# EasyEDA Pro project V4-POJ-STM32F103C8T6最小系统.epro

# Schematic Schematic1
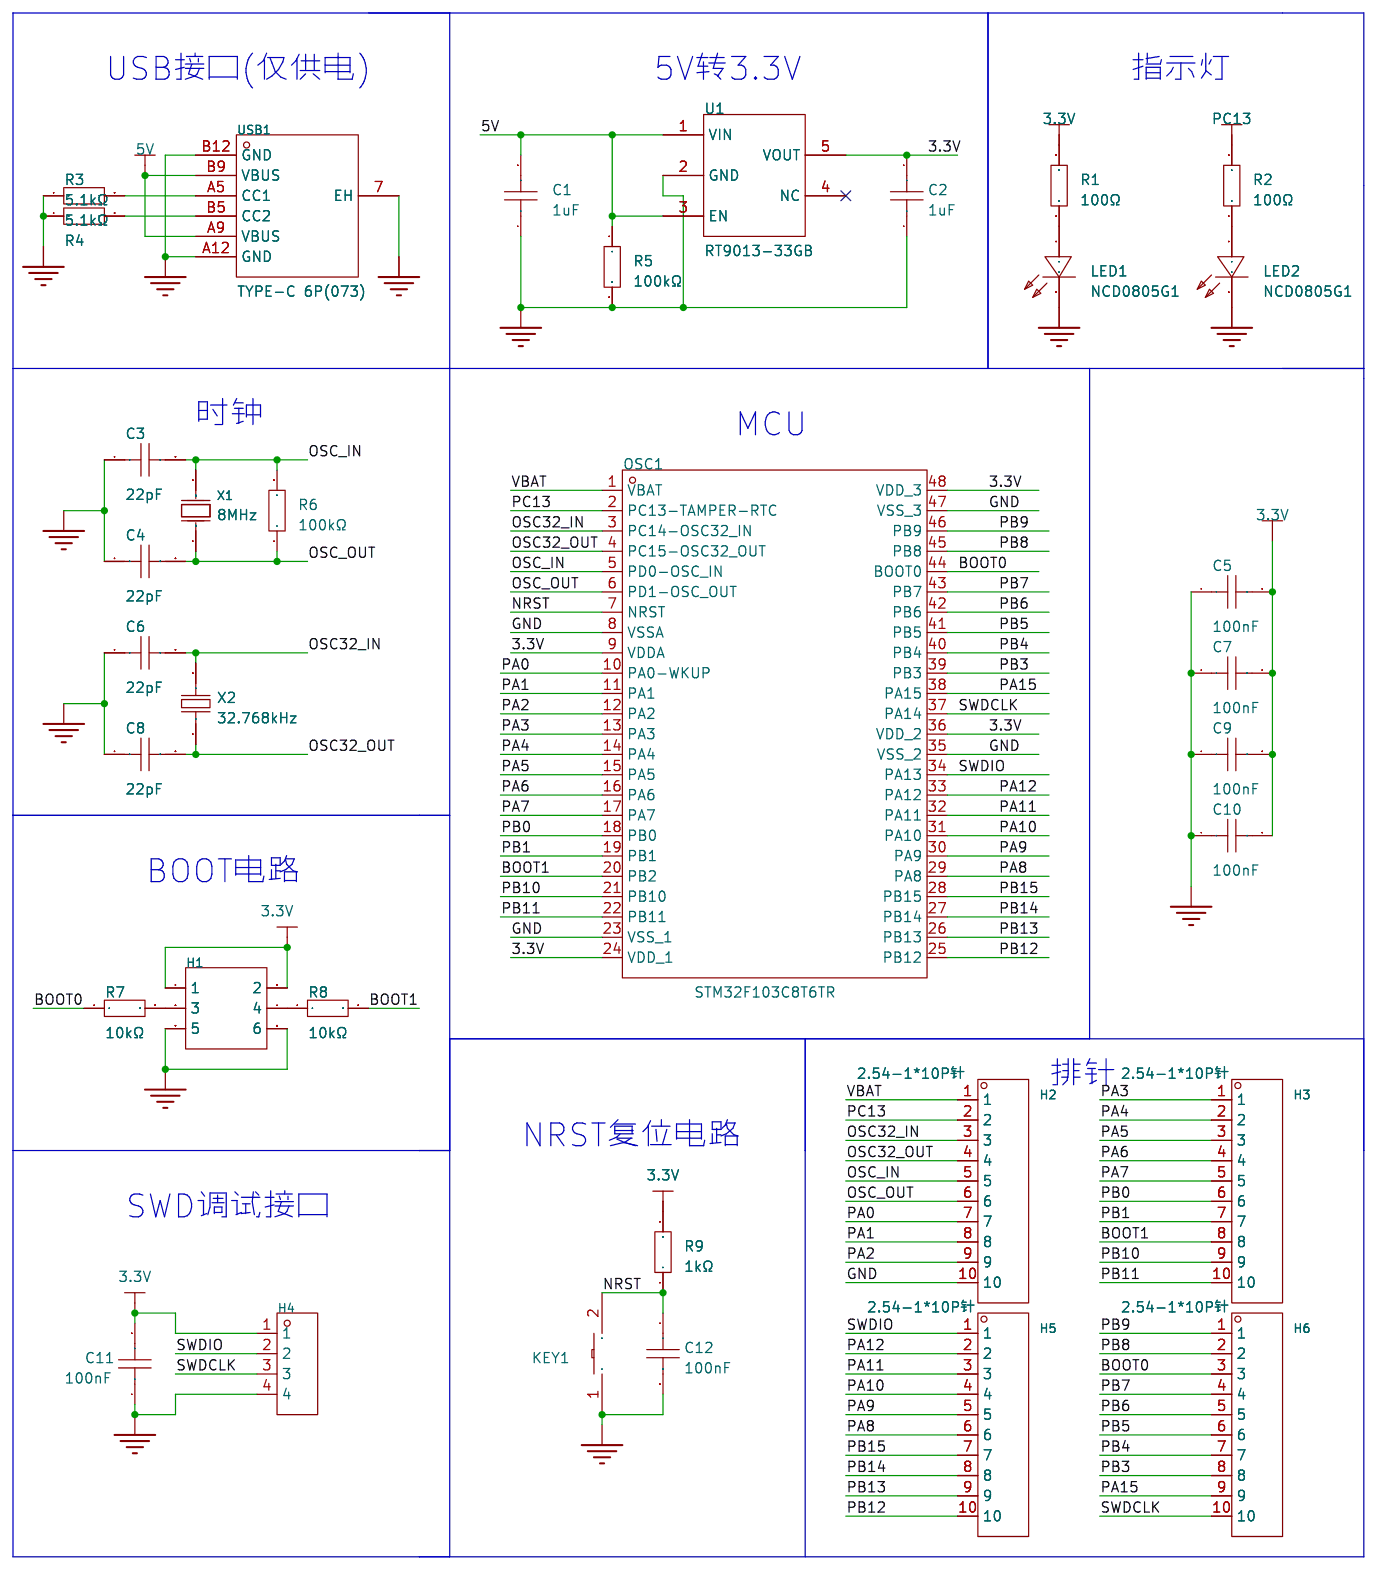
[diagram p0: schematic sheet]

## Parts
C1  1uF  [C0805]
C2  1uF  [C0805]
C3  22pF  [C0805]
C4  22pF  [C0805]
C5  100nF  [C0805]
C6  22pF  [C0805]
C7  100nF  [C0805]
C8  22pF  [C0805]
C9  100nF  [C0805]
C10  100nF  [C0805]
C11  100nF  [C0805]
C12  100nF  [C0805]
H1  2.54-2*3P针  [HDR-TH_6P-P2.54-V-M-R2-C3-S2.54-1]
H2  2.54-1*10P针  [HDR-TH_10P-P2.54-V-M-1]
H3  2.54-1*10P针  [HDR-TH_10P-P2.54-V-M-1]
H4  PZ254R-11-04P  [HDR-TH_4P-P2.54-H-M-W10.4]
H5  2.54-1*10P针  [HDR-TH_10P-P2.54-V-M-1]
H6  2.54-1*10P针  [HDR-TH_10P-P2.54-V-M-1]
KEY1  TS-1101-C-W  [SW-SMD_L6.0-W3.3-LS8.0]
LED1  NCD0805G1  [LED0805-R-RD]
LED2  NCD0805G1  [LED0805-R-RD]
OSC1  STM32F103C8T6TR  [LQFP-48_L7.0-W7.0-P0.50-LS9.0-BL]
R1  100Ω  [R0805]
R2  100Ω  [R0805]
R3  5.1kΩ  [R0805]
R4  5.1kΩ  [R0805]
R5  100kΩ  [R0805]
R6  100kΩ  [R0805]
R7  10kΩ  [R0805]
R8  10kΩ  [R0805]
R9  1kΩ  [R0805]
U1  RT9013-33GB  [SOT-23-5_L3.0-W1.7-P0.95-LS2.8-BL]
USB1  TYPE-C 6P(073)  [TYPE-C-SMD_TYPE-C-6P]
X1  8MHz  [CRYSTAL-SMD_L5.0-W3.2]
X2  32.768kHz  [FC-135R_L3.2-W1.5]

## Library data of the parts
C1 C2 = CL21B105KBFNNNE: 容值:1uF;精度:±10%;额定电压:50V;材质(温度系数):X7R;; LCSC Part Name: 1uF ±10% 50V; Supplier Part: C28323; Manufacturer: SAMSUNG(三星); Supplier Footprint: 0805; JLCPCB Part Class: Basic Part; Datasheet: https://atta.szlcsc.com/upload/public/pdf/source/20160103/1457707718219.pdf; Supplier: LCSC; Tolerance: ±10%; Voltage Rated: 50V; Temperature Coefficient: X7R
C3 C4 C6 C8 = 0805CG220J500NT: 容值:22pF;精度:±5%;额定电压:50V;材质(温度系数):C0G;; LCSC Part Name: 22pF ±5% 50V; Supplier Part: C24658; Manufacturer: FH(风华); Supplier Footprint: 0805; JLCPCB Part Class: Extended Part; Datasheet: https://atta.szlcsc.com/upload/public/pdf/source/20170923/C24658_1506149422956988697.pdf; Supplier: LCSC; Tolerance: ±5%; Voltage Rated: 50V; Temperature Coefficient: C0G
C5 C7 C9-C12 = 0805B104K500NT: 容值:100nF;精度:±10%;额定电压:50V;材质(温度系数):X7R;; LCSC Part Name: 100nF ±10% 50V; Supplier Part: C38141; Manufacturer: FH(风华); Supplier Footprint: 0805; JLCPCB Part Class: Extended Part; Datasheet: https://atta.szlcsc.com/upload/public/pdf/source/20170923/C38141_1506149447419988747.pdf; Supplier: LCSC; Tolerance: ±10%; Voltage Rated: 50V; Temperature Coefficient: X7R
H1 = 2.54-2*3P针: 排数:双排;总PIN位数:6P;间距:2.54mm;插针结构:-;行距:-;安装类型:直插;圆针/方针:-;额定电流:-;额定电压:-;配合针长度:-;塑高:-;触头材质:-;触头镀层:-;颜色:黑色;; LCSC Part Name: 2.54mm 直插; Supplier Part: C65114; Manufacturer: BOOMELE(博穆精密); Supplier Footprint: 插件,P=2.54mm; JLCPCB Part Class: Extended Part; Supplier: LCSC; Number of Rows: 双排; Number of Pins: 6P; Pitch: 2.54mm; Mounting Type: 直插; Color: 黑色
H2 H3 H5 H6 = 2.54-1*10P针: 排数:单排;总PIN位数:10;间距:2.54mm;插针结构:1x10P;行距:-;安装类型:直插;圆针/方针:方针;额定电流:3A;额定电压:-;配合针长度:-;塑高:-;端接针长度:-;触头材质:-;触头镀层:-;工作温度范围:-40℃~+105℃;颜色:黑色;; LCSC Part Name: 2.54mm 1x10P 直插 方针; Supplier Part: C57369; Manufacturer: BOOMELE(博穆精密); Supplier Footprint: 直插,P=2.54mm; JLCPCB Part Class: Extended Part; Supplier: LCSC; Number of Rows: 单排; Number of Pins: 10; Pitch: 2.54mm; Pin Structure: 1x10P; Mounting Type: 直插; Circluar Pins/Square Pins: 方针; Current Rating (Max): 3A; Operating Temperature Range: -40℃~+105℃; Color: 黑色
H4 = PZ254R-11-04P: 间距:2.54mm;总PIN位数:4;排数:1;插针结构:1x4P;行距:-;安装类型:弯插;圆针/方针:方针;额定电流:-;额定电压:-;配合针长度:6mm;塑高:2.5mm;触头材质:黄铜;触头镀层:-;工作温度范围:-40℃~+105℃;颜色:黑色;; LCSC Part Name: 2.54mm 1x4P 弯插 方针; Supplier Part: C492412; Manufacturer: XFCN(兴飞); Supplier Footprint: 插件,P=2.54mm; JLCPCB Part Class: Extended Part; Datasheet: https://atta.szlcsc.com/upload/public/pdf/source/20200309/C492403_F9F19131791D08044AD4F84F8E751A34.pdf; Supplier: LCSC; Pitch: 2.54mm; Number of Pins: 4; Number of Rows: 1; Pin Structure: 1x4P; Mounting Type: 弯插; Circluar Pins/Square Pins: 方针; Length of Mating Pin: 6mm; Insulation Height: 2.5mm; Contact Material: 黄铜; Operating Temperature Range: -40℃~+105℃; Color: 黑色; Length of End Connection Pin: 3mm
KEY1 = TS-1101-C-W: 触点电流:50mA;额定电压(AC):-;额定电压(DC):12V;额定功率:-;绝缘电阻:-;电路结构:单刀单掷;安装方式:立贴;带灯:无;作用力:260gf;机械寿命:5万次;带支架:否;; LCSC Part Name: 立贴 6*3.6*2.5mm 轻触开关 一型3*6*2.5有白ZD b拉伸白色带淡绿按键 卷装; Supplier Part: C318938; Manufacturer: XKB Connectivity(中国星坤); Supplier Footprint: SMD; JLCPCB Part Class: Extended Part; Datasheet: https://atta.szlcsc.com/upload/public/pdf/source/20200227/C318938_C2E53B1EEDE37D980A33616AC086DE53.pdf; Supplier: LCSC; Contact Current: 50mA; Voltage Rating (DC): 12V; Circuit: 单刀单掷; Mounting Style: 立贴; Actuator Style: 矩形按钮; Actuator/Cap Color: 白色带淡绿; With Lamp: 无; Operating Force: 260gf; Mechanical Life: 5万次; Operating Temperature: -30℃~+85℃; Switch Length: 6mm; Switch Width: 3.6mm; Switch Height: 2.5mm; Strike Gundam: 否
LED1 LED2 = NCD0805G1: 发光颜色:翠绿;; LCSC Part Name: 翠绿 0805翠绿  正贴; Supplier Part: C84260; Manufacturer: 国星光电; Supplier Footprint: 0805; JLCPCB Part Class: Extended Part; Datasheet: https://atta.szlcsc.com/upload/public/pdf/source/20200820/C84260_AFC7BF57C6FBA034D182BB8D10A67EFE.pdf; Supplier: LCSC; Emitted Color: 翠绿
OSC1 = STM32F103C8T6TR: Supplier Part: C2969777; Manufacturer: ST(意法半导体); Supplier Footprint: LQFP-48; JLCPCB Part Class: Extended Part; Datasheet: https://atta.szlcsc.com/upload/public/pdf/source/20220628/95EE8CB51361BFD20205E6D0986143A8.pdf; Supplier: LCSC
R1 R2 = 0805W8F1000T5E: 电阻类型:厚膜电阻;阻值:100Ω;精度:±1%;功率:125mW;; LCSC Part Name: 100Ω ±1% 125mW; Supplier Part: C17408; Manufacturer: UNI-ROYAL(厚声); Supplier Footprint: 0805; JLCPCB Part Class: Basic Part; Datasheet: https://atta.szlcsc.com/upload/public/pdf/source/20200306/C422600_1E6D84923E4A46A82E41ADD87F860B5C.pdf; Supplier: LCSC; Type: 厚膜电阻; Tolerance: ±1%; Power(Watts): 125mW; Temperature Coefficient: ±100ppm/℃; Overload Voltage (Max): 150V; Operating Temperature Range: -55℃~+155℃
R3 R4 = 0805W8F5101T5E: 电阻类型:厚膜电阻;阻值:5.1kΩ;精度:±1%;功率:125mW;; LCSC Part Name: 5.1kΩ ±1% 125mW; Supplier Part: C27834; Manufacturer: UNI-ROYAL(厚声); Supplier Footprint: 0805; JLCPCB Part Class: Basic Part; Datasheet: https://atta.szlcsc.com/upload/public/pdf/source/20200306/C422600_1E6D84923E4A46A82E41ADD87F860B5C.pdf; Supplier: LCSC; Type: 厚膜电阻; Tolerance: ±1%; Power(Watts): 125mW; Temperature Coefficient: ±100ppm/℃; Overload Voltage (Max): 150V; Operating Temperature Range: -55℃~+155℃
R5 R6 = 0805W8F1003T5E: 阻值:100kΩ;精度:±1%;功率:125mW;温度系数:±100ppm/℃;电阻类型:厚膜电阻;; LCSC Part Name: 100kΩ ±1% 125mW 厚膜电阻; Supplier Part: C149504; Manufacturer: UNI-ROYAL(厚声); Supplier Footprint: 0805; JLCPCB Part Class: Basic Part; Datasheet: https://atta.szlcsc.com/upload/public/pdf/source/20200306/C422600_1E6D84923E4A46A82E41ADD87F860B5C.pdf; Supplier: LCSC; Type: 厚膜电阻; Tolerance: ±1%; Power(Watts): 125mW; Temperature Coefficient: ±100ppm/℃; Overload Voltage (Max): 150V; Operating Temperature Range: -55℃~+155℃
R7 R8 = 0805W8F1002T5E_C17414: 电阻类型:厚膜电阻;阻值:10kΩ;精度:±1%;功率:125mW;; LCSC Part Name: 10kΩ ±1% 125mW; Supplier Part: C17414; Manufacturer: UNI-ROYAL(厚声); Manufacturer Part: 0805W8F1002T5E; Supplier Footprint: 0805; JLCPCB Part Class: Basic Part; Datasheet: https://atta.szlcsc.com/upload/public/pdf/source/20200306/C422600_1E6D84923E4A46A82E41ADD87F860B5C.pdf; Supplier: LCSC; Type: 厚膜电阻; Tolerance: ±1%; Power(Watts): 125mW; Temperature Coefficient: ±100ppm/℃; Overload Voltage (Max): 150V; Operating Temperature Range: -55℃~+155℃
R9 = 0805W8F1001T5E: 电阻类型:厚膜电阻;阻值:1kΩ;精度:±1%;功率:125mW;; LCSC Part Name: 1kΩ ±1% 125mW; Supplier Part: C17513; Manufacturer: UNI-ROYAL(厚声); Supplier Footprint: 0805; JLCPCB Part Class: Basic Part; Datasheet: https://atta.szlcsc.com/upload/public/pdf/source/20200306/C422600_1E6D84923E4A46A82E41ADD87F860B5C.pdf; Supplier: LCSC; Type: 厚膜电阻; Tolerance: ±1%; Power(Watts): 125mW; Temperature Coefficient: ±100ppm/℃; Overload Voltage (Max): 150V; Operating Temperature Range: -55℃~+155℃
U1 = RT9013-33GB: 输出类型:固定;输出极性:正;最大输入电压:5.5V;输出电压:3.3V;输出电流:500mA;电源纹波抑制比(PSRR):50dB@(10kHz);; LCSC Part Name: 输入5.5V 输出3.3V 500mA; Supplier Part: C47773; Manufacturer: RICHTEK(立锜); Supplier Footprint: SOT-23-5; JLCPCB Part Class: Extended Part; Datasheet: https://atta.szlcsc.com/upload/public/pdf/source/20150504/1457707282459.pdf; Supplier: LCSC; Output Type: 固定; Output Polarity: 正; Number of Outputs: 1; Maximum Input Voltage: 5.5V; Output Voltage: 3.3V; Dropout Voltage: 400mV@(500mA); Quiescent Current (Ground Current): 50uA; Output Current: 500mA; Power Supply Rejection Ratio (PSRR): 50dB@(10kHz); Operating Temperature: -40℃~+85℃
USB1 = TYPE-C 6P(073): 连接器类型:Type-C;标准:-;公母:母座;触点数量:6P;端口数量:1;安装方式:卧贴;额定电流 - 电源:5A;工作温度范围:-25℃~+85℃;; LCSC Part Name: Type-C 母座 卧贴; Supplier Part: C668623; Manufacturer: SHOU HAN(首韩); Supplier Footprint: SMD; JLCPCB Part Class: Extended Part; Datasheet: https://atta.szlcsc.com/upload/public/pdf/source/20200618/C668623_A4B260DED7AC1949BAC6AE39E9F4CD80.pdf; Supplier: LCSC; Connector Type: Type-C; Gender: 母座; Number of Contacts: 6P; Number of Ports: 1; Mounting Style: 卧贴; Current Rating - Power (Max): 5A; Operating Temperature Range: -25℃~+85℃
X1 = X50328MSB2GI: 频率:8MHz;负载电容:20pF;频率公差:±10ppm;; LCSC Part Name: 8MHz ±10ppm 20pF YSX530GA YSX530GA; Supplier Part: C115962; Manufacturer: YXC(扬兴晶振); Supplier Footprint: SMD5032-2P; JLCPCB Part Class: Basic Part; Datasheet: https://atta.szlcsc.com/upload/public/pdf/source/20230220/0EBFFB9D6D8CE6A211407822BBB6C516.pdf; Supplier: LCSC; Crystal Type: 贴片无源晶振; Frequency Tolerance: ±10ppm; Frequency Stability: ±50ppm; Load Capacitance: 20pF; Operating Temperature: -40℃~+85℃
X2 = Q13FC1350000400: 频率:32.768kHz;频率公差:±20ppm;负载电容:12.5pF;; LCSC Part Name: 32.768kHz ±20ppm 12.5pF; Supplier Part: C32346; Manufacturer: EPSON(爱普生); Supplier Footprint: SMD3215-2P; JLCPCB Part Class: Basic Part; Datasheet: https://atta.szlcsc.com/upload/public/pdf/source/20190108/C32346_746D6B07EAF90824457A96480007685F.pdf; Supplier: LCSC; Crystal Type: 贴片无源晶振; Frequency Tolerance: ±20ppm; Load Capacitance: 12.5pF; Equivalent Series Resistance (ESR): 70kΩ; Operating Temperature: -40℃~+85℃

## Nets
3.3V: C2.2 C5.2 C7.2 C9.2 C10.2 C11.2 H1.1 H1.2 H4.1 OSC1.9(VDDA) OSC1.24(VDD_1) OSC1.36(VDD_2) OSC1.48(VDD_3) R1.2 R9.2 U1.5(VOUT)
5V: C1.2 R5.1 U1.1(VIN) U1.3(EN) USB1.A9(VBUS) USB1.B9(VBUS)
GND: C1.1 C2.1 C3.1 C4.1 C5.1 C6.1 C7.1 C8.1 C9.1 C10.1 C11.1 C12.2 H1.5 H1.6 H2.10 H4.4 KEY1.1 LED1.2(K) LED2.2(K) OSC1.8(VSSA) OSC1.23(VSS_1) OSC1.35(VSS_2) OSC1.47(VSS_3) R3.1 R4.1 R5.2 U1.2(GND) USB1.7(EH) USB1.A12(GND) USB1.B12(GND)
VBAT: H2.1 OSC1.1(VBAT)
BOOT0: H6.3 OSC1.44(BOOT0) R7.1
BOOT1: H3.8 OSC1.20(PB2) R8.2
NRST: C12.1 KEY1.2 OSC1.7(NRST) R9.1
OSC32_IN: C6.2 H2.3 OSC1.3(PC14-OSC32_IN) X2.2
OSC32_OUT: C8.2 H2.4 OSC1.4(PC15-OSC32_OUT) X2.1
OSC_IN: C3.2 H2.5 OSC1.5(PD0-OSC_IN) R6.2 X1.2(OSC2)
OSC_OUT: C4.2 H2.6 OSC1.6(PD1-OSC_OUT) R6.1 X1.1(OSC1)
PA0: H2.7 OSC1.10(PA0-WKUP)
PA1: H2.8 OSC1.11(PA1)
PA2: H2.9 OSC1.12(PA2)
PA3: H3.1 OSC1.13(PA3)
PA4: H3.2 OSC1.14(PA4)
PA5: H3.3 OSC1.15(PA5)
PA6: H3.4 OSC1.16(PA6)
PA7: H3.5 OSC1.17(PA7)
PA8: H5.6 OSC1.29(PA8)
PA9: H5.5 OSC1.30(PA9)
PA10: H5.4 OSC1.31(PA10)
PA11: H5.3 OSC1.32(PA11)
PA12: H5.2 OSC1.33(PA12)
PA15: H6.9 OSC1.38(PA15)
PB0: H3.6 OSC1.18(PB0)
PB1: H3.7 OSC1.19(PB1)
PB3: H6.8 OSC1.39(PB3)
PB4: H6.7 OSC1.40(PB4)
PB5: H6.6 OSC1.41(PB5)
PB6: H6.5 OSC1.42(PB6)
PB7: H6.4 OSC1.43(PB7)
PB8: H6.2 OSC1.45(PB8)
PB9: H6.1 OSC1.46(PB9)
PB10: H3.9 OSC1.21(PB10)
PB11: H3.10 OSC1.22(PB11)
PB12: H5.10 OSC1.25(PB12)
PB13: H5.9 OSC1.26(PB13)
PB14: H5.8 OSC1.27(PB14)
PB15: H5.7 OSC1.28(PB15)
PC13: H2.2 OSC1.2(PC13-TAMPER-RTC) R2.2
SWDCLK: H4.3 H6.10 OSC1.37(PA14)
SWDIO: H4.2 H5.1 OSC1.34(PA13)
Net-(H1-3): H1.3 R7.2
Net-(H1-4): H1.4 R8.1
Net-(LED1-1): LED1.1(A) R1.1
Net-(LED2-1): LED2.1(A) R2.1
Net-(R3-2): R3.2 USB1.A5(CC1)
Net-(R4-2): R4.2 USB1.B5(CC2)

Not connected (* = marked no-connect by the designer): U1 4(NC)*

## Notes on the sheet
- USB接口(仅供电)
- 5V转3.3V
- 指示灯
- 时钟
- MCU
- BOOT电路
- 排针
- NRST复位电路
- SWD调试接口

# Board PCB2
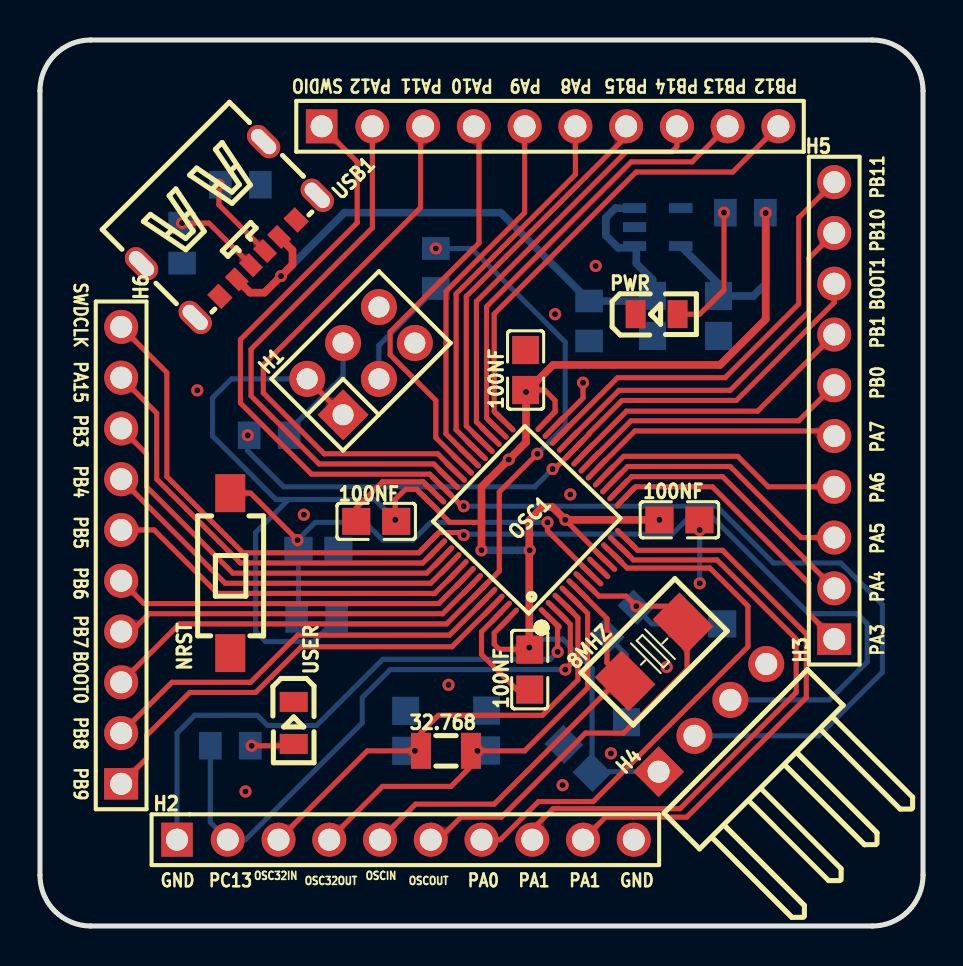
[diagram p1: board, top side]
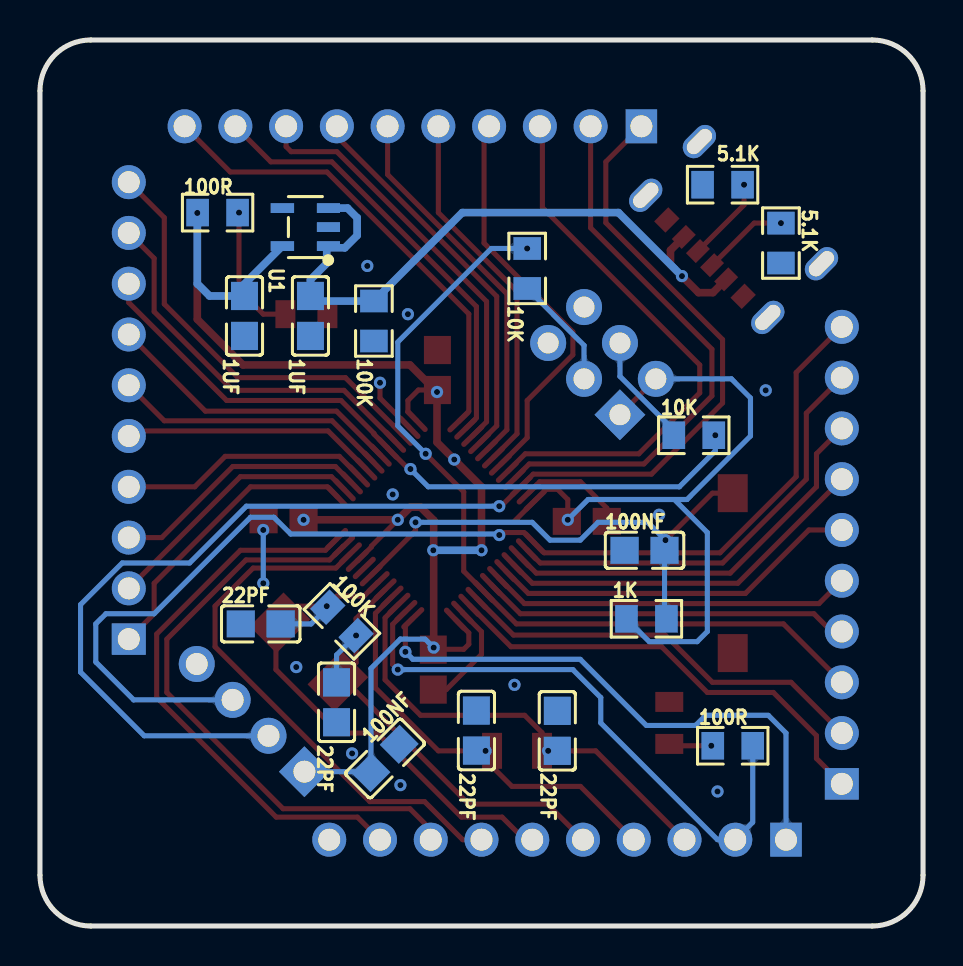
[diagram p2: board, bottom side, seen from below]

Outline 44.2 x 44.32 mm; copper layers: Top Layer, Bottom Layer. Coordinates in mm from the lower left corner of the outline.
Outline path: 0,41.78 0,2.54 arc(0.74,0.74) 2.54,0 41.66,0 arc(43.45,0.74) 44.2,2.54 44.2,41.78 arc(43.45,43.58) 41.66,44.32 2.54,44.32 arc(0.74,43.58) 0,41.78
Stack: Top Layer 0.035mm / Dielectric1 1.51mm FR4 er 4.5 / Bottom Layer 0.035mm

## Design rules (mm)
template: JLCPCB Capability(Two Layers Board)
spacing copperThickness1oz (default): track to track 0.102, other pairs 0.152 to 0.3
spacing copperThickness2oz: track to track 0.203, other pairs 0.152 to 0.3
track width copperThickness1oz (default): min 0.127, default 0.254, max 2.54
track width copperThickness2oz: min 0.203, default 0.254, max 2.54
differential pair differentialPair (default): width min 0.127, default 0.254, max 2.54; gap min 0.152, default 0.152
via viaSize (default): diameter min 0.5, default 0.61, max 10; hole min 0.3, default 0.305, max 6.3

## Placement (name value [footprint] x y rotation side)
1K  1kΩ  [R0805]  13.84 15.37 0 bottom
1UF  -  [C0805]  30.66 30.52 90 bottom
1UF#2  -  [C0805]  33.96 30.52 90 bottom
5.1K  -  [R0805]  10.03 37.08 180 bottom
5.1K#2  -  [R0805]  7.11 34.16 90 bottom
8MHZ  8MHz  [CRYSTAL-SMD_L5.0-W3.2]  30.73 13.72 225 top
10K  -  [R0805]  19.81 32.89 270 bottom
10K#2  -  [R0805]  11.47 24.55 180 bottom
22PF  -  [C0805]  29.35 11.19 90 bottom
22PF#2  -  [C0805]  33.15 15.11 180 bottom
22PF#3  -  [C0805]  18.3 9.76 270 bottom
22PF#4  -  [C0805]  22.35 9.78 270 bottom
32.768  32.768kHz  [FC-135R_L3.2-W1.5]  20.32 8.76 180 top
100K  -  [R0805]  27.48 30.26 270 bottom
100K#2  -  [R0805]  29.08 15.24 225 bottom
100NF  -  [C0805]  32 20.32 180 top
100NF#2  -  [C0805]  16.83 20.24 0 top
100NF#3  -  [C0805]  24.3 27.81 270 top
100NF#4  -  [C0805]  24.51 12.83 90 top
100NF#5  -  [C0805]  26.92 8.38 315 bottom
100NF#6  -  [C0805]  13.94 18.8 0 bottom
100R  -  [R0805]  35.31 35.69 0 bottom
100R#2  -  [R0805]  9.52 9.02 180 bottom
H1  2.54-2*3P针  [HDR-TH_6P-P2.54-V-M-R2-C3-S2.54-1]  16.07 28.27 45 top
H2  2.54-1*10P针  [HDR-TH_10P-P2.54-V-M-1]  18.29 4.32 0 top
H3  2.54-1*10P针  [HDR-TH_10P-P2.54-V-M-1]  39.75 25.78 90 top
H4  PZ254R-11-04P  [HDR-TH_4P-P2.54-H-M-W10.4]  33.66 10.41 45 top
H5  2.54-1*10P针  [HDR-TH_10P-P2.54-V-M-1]  25.53 40.01 0 top
H6  2.54-1*10P针  [HDR-TH_10P-P2.54-V-M-1]  4.06 18.54 90 top
NRST  TS-1101-C-W  [SW-SMD_L6.0-W3.3-LS8.0]  9.52 17.65 90 top
OSC1  STM32F103C8T6TR  [LQFP-48_L7.0-W7.0-P0.50-LS9.0-BL]  24.38 20.32 46.1 top
PWR  NCD0805G1  [LED0805-R-RD]  30.86 30.61 0 top
U1  RT9013-33GB  [SOT-23-5_L3.0-W1.7-P0.95-LS2.8-BL]  30.91 34.96 90 bottom
USB1  TYPE-C 6P(073)  [TYPE-C-SMD_TYPE-C-6P]  9.52 34.8 225 top
USER  NCD0805G1  [LED0805-R-RD]  12.7 10.16 270 top

## Footprints (pads in the part's own frame, mm; a bottom-side part is the same pattern mirrored in y, then rotated)
C0805
  rect 1.41x1.35 smd: 1(-1,0) 2(1,0)
CRYSTAL-SMD_L5.0-W3.2
  rect 1.9x2.4 smd: 1(-2.05,0) 2(2.05,0)
FC-135R_L3.2-W1.5
  rect 1x1.8 smd: 1(-1.25,0) 2(1.25,0)
HDR-TH_4P-P2.54-H-M-W10.4
  rect 1.8x1.8 hole 1.1: 1(-3.81,0)
  round 1.8 hole 1.1: 2(-1.27,0) 3(1.27,0) 4(3.81,0)
HDR-TH_6P-P2.54-V-M-R2-C3-S2.54-1
  rect 1.8x1.8 hole 1.05: 1(-2.54,-1.27)
  round 1.8 hole 1.05: 2(-2.54,1.27) 3(0,-1.27) 4(0,1.27) 5(2.54,-1.27) 6(2.54,1.27)
HDR-TH_10P-P2.54-V-M-1
  rect 1.575x1.7 hole 1.1: 1(-11.43,0)
  round 1.7 hole 1.1: 2(-8.89,0) 3(-6.35,0) 4(-3.81,0) 5(-1.27,0) 6(1.27,0) 7(3.81,0) 8(6.35,0) 9(8.89,0) 10(11.43,0)
LED0805-R-RD
  rect 1x1.399 smd: 1(1.05,0) 2(-1.05,0)
LQFP-48_L7.0-W7.0-P0.50-LS9.0-BL
  oval 0.27x1.5 smd: 1(-2.75,-4.25) 2(-2.25,-4.25) 3(-1.75,-4.25) 4(-1.25,-4.25) 5(-0.75,-4.25) 6(-0.25,-4.25) 7(0.25,-4.25) 8(0.75,-4.25) 9(1.25,-4.25) 10(1.75,-4.25) 11(2.25,-4.25) 12(2.75,-4.25) 25(2.75,4.25) 26(2.25,4.25) 27(1.75,4.25) 28(1.25,4.25) 29(0.75,4.25) 30(0.25,4.25) 31(-0.25,4.25) 32(-0.75,4.25) 33(-1.25,4.25) 34(-1.75,4.25) 35(-2.25,4.25) 36(-2.75,4.25)
  oval 1.5x0.27 smd: 13(4.25,-2.75) 14(4.25,-2.25) 15(4.25,-1.75) 16(4.25,-1.25) 17(4.25,-0.75) 18(4.25,-0.25) 19(4.25,0.25) 20(4.25,0.75) 21(4.25,1.25) 22(4.25,1.75) 23(4.25,2.25) 24(4.25,2.75) 37(-4.25,2.75) 38(-4.25,2.25) 39(-4.25,1.75) 40(-4.25,1.25) 41(-4.25,0.75) 42(-4.25,0.25) 43(-4.25,-0.25) 44(-4.25,-0.75) 45(-4.25,-1.25) 46(-4.25,-1.75) 47(-4.25,-2.25) 48(-4.25,-2.75)
R0805
  rect 1.133x1.377 smd: 1(-1,0) 2(1,0)
SOT-23-5_L3.0-W1.7-P0.95-LS2.8-BL
  rect 0.49x1.157 smd: 1(-0.95,-1.153) 2(0,-1.153) 3(0.95,-1.153)
  rect 0.49x1.175 smd: 4(0.95,1.153) 5(-0.95,1.153)
SW-SMD_L6.0-W3.3-LS8.0
  rect 1.9x1.5 smd: 1(-4,0) 2(4,0)
TYPE-C-SMD_TYPE-C-6P
  oval 1.1x1.9 hole 0.7x1.5: 7(-4.32,1.837) 7(-4.32,-1.962) 7(4.32,1.837) 7(4.32,-1.962)
  rect 0.7x1 smd: A5(-0.5,1.962) A9(1.5,1.962) B5(0.5,1.962) B9(-1.5,1.962)
  rect 0.8x1 smd: A12(2.7,1.962) B12(-2.7,1.962)

## Nets
3.3V: 1K.2 1UF#2.2 100NF.2 100NF#2.2 100NF#3.2 100NF#4.2 100NF#5.2 100R.2 H1.1 H1.2 H4.1 OSC1.9 OSC1.24 OSC1.36 OSC1.48 U1.5
5V: 1UF.2 100K.1 U1.1 U1.3 USB1.A9 USB1.B9
GND: 1UF.1 1UF#2.1 5.1K.1 5.1K#2.1 22PF.1 22PF#2.1 22PF#3.1 22PF#4.1 100K.2 100NF.1 100NF#2.1 100NF#3.1 100NF#4.1 100NF#5.1 100NF#6.2 H1.5 H1.6 H2.10 H4.4 NRST.1 OSC1.8 OSC1.23 OSC1.35 OSC1.47 PWR.2 U1.2 USB1.7 USB1.A12 USB1.B12 USER.2
VBAT: H2.1 OSC1.1
BOOT0: 10K.1 H6.3 OSC1.44
BOOT1: 10K#2.2 H3.8 OSC1.20
NRST: 1K.1 100NF#6.1 NRST.2 OSC1.7
OSC32_IN: 22PF#3.2 32.768.2 H2.3 OSC1.3
OSC32_OUT: 22PF#4.2 32.768.1 H2.4 OSC1.4
OSC_IN: 8MHZ.2 22PF.2 100K#2.2 H2.5 OSC1.5
OSC_OUT: 8MHZ.1 22PF#2.2 100K#2.1 H2.6 OSC1.6
PA0: H2.7 OSC1.10
PA1: H2.8 OSC1.11
PA2: H2.9 OSC1.12
PA3: H3.1 OSC1.13
PA4: H3.2 OSC1.14
PA5: H3.3 OSC1.15
PA6: H3.4 OSC1.16
PA7: H3.5 OSC1.17
PA8: H5.6 OSC1.29
PA9: H5.5 OSC1.30
PA10: H5.4 OSC1.31
PA11: H5.3 OSC1.32
PA12: H5.2 OSC1.33
PA15: H6.9 OSC1.38
PB0: H3.6 OSC1.18
PB1: H3.7 OSC1.19
PB3: H6.8 OSC1.39
PB4: H6.7 OSC1.40
PB5: H6.6 OSC1.41
PB6: H6.5 OSC1.42
PB7: H6.4 OSC1.43
PB8: H6.2 OSC1.45
PB9: H6.1 OSC1.46
PB10: H3.9 OSC1.21
PB11: H3.10 OSC1.22
PB12: H5.10 OSC1.25
PB13: H5.9 OSC1.26
PB14: H5.8 OSC1.27
PB15: H5.7 OSC1.28
PC13: 100R#2.2 H2.2 OSC1.2
SWDCLK: H4.3 H6.10 OSC1.37
SWDIO: H4.2 H5.1 OSC1.34
$1N5715: 100R.1 PWR.1
$1N6381: 10K.2 H1.3
$1N6407: 10K#2.1 H1.4
$1N15357: 100R#2.1 USER.1
$1N15535: 5.1K#2.2 USB1.B5
$1N15536: 5.1K.2 USB1.A5

Pads without a net: U1 4

## Via types
v1: diameter 0.61, hole 0.305, Top Layer to Bottom Layer, 41 vias

## Routing (per net, layer and track width the routed paths; a pad name or vN(x,y) marks a point on that pad's centre or on a via; arc(x,y) is an arc through that point)
3.3V: length 113.4
  Top Layer w0.254: 25.35,25.29 25.78,25.72 25.78,26.29 25.26,26.81 24.42,26.81 ; 22.1,20.19 20.51,20.19 18.86,21.84 18.29,21.84 17.78,21.34 v1(17.78,20.32) 17.83,20.27 100NF#2.2 ; 23.42,15.35 22.73,14.67 22.73,14.1 22.99,13.84 24.5,13.84 100NF#4.2 ; OSC1.9 28.3,18.27 27.61,18.96 27.61,19 v1(26.29,20.32) ; 100NF#3.2 24.42,26.81 ; 24.42,26.81 v1(24.33,26.71) ; H1.2 H1.1
  Top Layer w0.381: v1(24.33,26.71) 24.33,24.2 v1(23.46,23.34) 22.1,21.97 v1(22.1,18.8) ; 36.32,35.69 36.32,30.35 34.04,28.07 25.68,28.07 24.42,26.81 ; v1(24.49,13.93) 24.49,20.3 25.15,20.96 25.65,20.96 v1(26.29,20.32) v1(31,20.32)
  Bottom Layer w0.254: 1K.2 13.7,14.22 11.3,14.22 10.8,14.73 10.8,19.69 12.45,21.34 ; v1(36.32,35.67) 100R.2 ; 12.45,21.34 11.81,21.34 8.64,24.51 8.64,26.42 9.59,27.37 H1.2 ; 12.45,21.34 16.76,21.34 v1(17.78,20.32) ; H4.1 27.68,7.72 100NF#5.2 27.63,12.88 26.16,14.35 24.92,14.35 v1(24.49,13.93)
  Bottom Layer w0.381: v1(36.32,35.67) 36.32,32.13 35.71,31.52 1UF#2.2 33.96,32.12 32.07,34.01 ; v1(24.51,18.8) v1(22.1,18.8)
5V: length 34.3
  Top Layer w0.381: USB1.A9 10.52,31.68 11.24,31.68 v1(12.07,32.51) 12.64,33.09 12.64,33.81 USB1.B9
  Bottom Layer w0.254: 29.85,33.93 29.76,34.01
  Bottom Layer w0.381: v1(12.07,32.51) 15.24,35.69 23.06,35.69 100K.1 30.4,31.26 1UF.2 30.66,32.33 29.85,33.15 29.85,33.93 28.94,33.93 28.32,34.54 28.32,35.43 28.8,35.91 U1.3
GND: length 16.5
  Top Layer w0.254: 100NF#2.1 15.83,20.91 17.14,22.23 19.18,22.23 OSC1.35 ; v1(27.18,27.18) 27.18,26.41 OSC1.23 ; OSC1.47 23.06,15.68 22.1,14.72 22.1,13.59 23.86,11.83 100NF#4.1
  Bottom Layer w0.254: v1(33.02,19.81) v1(33.02,17.15)
  vias: v1(7.87,26.8) v1(10.29,6.73) v1(13.21,20.57) v1(20.45,12.07) v1(25.78,30.61) v1(26.16,7.05) v1(26.54,21.59) v1(27.81,33.02) v1(28.58,8.64) v1(31.37,12.95)
VBAT: length 28.3
  Top Layer w0.254: v1(25.91,13.72) 25.91,15.02 25.54,15.39
  Bottom Layer w0.254: H2.1 6.86,9.65 7.75,10.54 10.88,10.54 11.38,10.03 13.85,10.03 17.16,13.34 25.53,13.34 v1(25.91,13.72)
BOOT0: length 42.5
  Top Layer w0.254: v1(24.89,23.62) 22.99,21.72 22.99,17.75 OSC1.44 20.35,15.11 6.98,15.11 H6.3
  Bottom Layer w0.254: v1(24.89,23.62) 26.29,25.02 26.29,29.21 21.61,33.89 v1(19.81,33.89)
BOOT1: length 35.7
  Top Layer w0.254: H3.8 39.75,31.19 34.85,26.29 29.13,26.29 27.48,24.64 27.48,24.61 26.79,23.92 OSC1.20 25.75,22.86 v1(25.65,22.86)
  Bottom Layer w0.254: v1(25.65,22.86) 24.77,21.97 12.19,21.97 10.4,23.77 v1(10.4,24.55)
NRST: length 25
  Top Layer w0.254: OSC1.7 25.4,19.77 v1(25.4,20.19) ; v1(12.89,19.3) 10.54,21.65 NRST.2
  Bottom Layer w0.254: v1(25.4,20.19) 19.56,20.19 18.67,19.3 17.16,19.3 16.27,20.19 13.78,20.19 v1(12.89,19.3) ; 100NF#6.1 12.94,15.46 1K.1
OSC32_IN: length 22.9
  Top Layer w0.254: OSC1.3 26.92,15.42 26.92,12.32 25.15,10.54 19.94,10.54 19.07,9.67 32.768.2 v1(18.76,8.76) 16.38,8.76 H2.3
OSC32_OUT: length 21.4
  Top Layer w0.254: OSC1.4 27.41,15.64 27.41,11.91 24.26,8.76 v1(21.9,8.76) 32.768.1 21.46,8.66 21.46,7.87 20.57,6.99 17.14,6.99 H2.4
OSC_IN: length 23.8
  Top Layer w0.254: 26.92,16.83 28.38,15.38 v1(28.38,14.53) 28.38,13.18 8MHZ.2 28.9,12.27 22.73,6.1 18.8,6.1 H2.5
  Bottom Layer w0.254: 22PF.2 29.35,13.56 v1(28.38,14.53)
OSC_OUT: length 27.2
  Top Layer w0.254: OSC1.6 27.29,17.19 27.98,16.5 29.34,16.5 v1(29.84,16) 31.35,16 8MHZ.1 32.39,14.96 32.39,12.83 29.21,9.65 27.3,9.65 23.1,5.45 21.07,5.45 19.94,4.32 H2.6
  Bottom Layer w0.254: 29.79,15.95 30.62,15.11 22PF#2.2
PA0: length 27.2
  Top Layer w0.254: H2.7 23.04,4.32 24.95,6.22 27.69,6.22 35.43,13.97 35.43,16 33.53,17.91 29.39,17.91 OSC1.10
PA1: length 30
  Top Layer w0.254: OSC1.11 29.02,18.99 29.7,18.31 33.88,18.31 37.85,14.35 37.85,11.68 32.03,5.87 25.68,5.87 24.64,4.83 H2.8
PA2: length 28.3
  Top Layer w0.254: H2.9 28.31,5.45 32.37,5.45 38.35,11.43 38.35,14.61 34.16,18.8 29.91,18.8 29.35,19.35
PA3: length 14.7
  Top Layer w0.254: OSC1.13 29.81,21.97 33.66,21.97 38.48,17.15 38.48,15.62 H3.1
PA4: length 13.4
  Top Layer w0.254: H3.2 34.16,22.48 29.61,22.48 OSC1.14
PA5: length 13
  Top Layer w0.254: H3.3 38.1,19.43 34.54,22.99 29.41,22.99 OSC1.15
PA6: length 12.6
  Top Layer w0.254: H3.4 36.45,21.97 34.92,23.5 29.21,23.5 OSC1.16
PA7: length 12.8
  Top Layer w0.254: H3.5 39.5,24.77 29.78,24.77 OSC1.17
PA8: length 19.1
  Top Layer w0.254: H5.6 26.8,37.59 20.83,31.62 20.83,24.82 21.84,23.81
PA9: length 18.7
  Top Layer w0.254: H5.5 24.26,35.69 20.32,31.75 20.32,24.62 OSC1.30
PA10: length 20.4
  Top Layer w0.254: OSC1.31 19.81,24.43 19.81,26.29 17.53,28.58 17.53,29.72 21.97,34.16 21.97,39.75 H5.4
PA11: length 27.9
  Top Layer w0.254: H5.3 19.05,39.88 19.05,35.94 11.18,28.07 11.18,26.67 14.22,23.62 19.91,23.62 OSC1.32
PA12: length 27.6
  Top Layer w0.254: H5.2 16.64,34.93 10.57,28.85 10.57,26.52 13.97,23.11 19.71,23.11 OSC1.33
PA15: length 21.8
  Top Layer w0.254: H6.9 5.84,25.65 5.84,22.35 10.03,18.16 19.16,18.16 OSC1.38
PB0: length 13.8
  Top Layer w0.254: H3.6 37.97,25.27 29.58,25.27 OSC1.18
PB1: length 15.1
  Top Layer w0.254: OSC1.19 29.35,25.76 35.92,25.76 H3.7
PB3: length 20.4
  Top Layer w0.254: OSC1.39 19.36,17.65 9.65,17.65 5.33,21.97 5.33,23.62 H6.8
PB4: length 19
  Top Layer w0.254: H6.7 9.27,17.15 19.55,17.15 OSC1.40
PB5: length 18.6
  Top Layer w0.254: OSC1.41 19.75,16.64 8.89,16.64 5.72,19.81 H6.6
PB6: length 18.2
  Top Layer w0.254: H6.5 5.21,16.13 19.95,16.13 OSC1.42
PB7: length 18.5
  Top Layer w0.254: OSC1.43 20.15,15.62 5.46,15.62 4.57,14.73 H6.4
PB8: length 21.1
  Top Layer w0.254: OSC1.45 20.5,14.55 12.9,14.55 10.54,12.19 6.6,12.19 H6.2
PB9: length 23
  Top Layer w0.254: 22.7,16.05 20.62,13.97 13.08,13.97 10.8,11.68 7.49,11.68 5.33,9.53 5.33,8.38 H6.1
PB10: length 19.2
  Top Layer w0.254: H3.9 38.48,33.4 38.48,30.73 34.54,26.8 28.98,26.8 OSC1.21
PB11: length 21.4
  Top Layer w0.254: H3.10 37.97,35.43 37.97,31.12 34.29,27.43 28.91,27.43 26.07,24.6
PB12: length 23.7
  Top Layer w0.254: 23.23,25.25 22.73,25.75 22.73,30.62 29.83,37.72 34.67,37.72 H5.10
PB13: length 22.1
  Top Layer w0.254: OSC1.26 22.35,25.42 22.35,30.99 29.59,38.23 32.64,38.23 H5.9
PB14: length 21.3
  Top Layer w0.254: H5.8 31.88,38.99 31.62,38.74 29.34,38.74 21.84,31.24 21.84,25.22 OSC1.27
PB15: length 19.5
  Top Layer w0.254: OSC1.28 21.34,25.02 21.34,31.5 29.34,39.5 H5.7
PC13: length 29.5
  Top Layer w0.254: OSC1.2 26.54,15.09 26.54,13.08 v1(26.29,12.83)
  Bottom Layer w0.254: v1(26.29,12.83) 17.53,12.83 16.13,11.43 16.13,10.16 10.29,4.32 H2.2 8.52,5.19 100R#2.2
SWDCLK: length 57.7
  Top Layer w0.254: v1(21.21,19.56) 21.08,19.69 19.97,19.69 OSC1.37 18.96,18.67 10.16,18.67 6.35,22.48 6.35,27.69 H6.10
  Bottom Layer w0.254: 34.55,11.31 39.51,11.31 41.4,13.21 41.4,15.11 40.89,15.62 38.48,15.62 33.66,20.45 32.48,20.45 31.64,19.61 21.26,19.61 v1(21.21,19.56)
SWDIO: length 67.4
  Top Layer w0.254: H5.1 15.88,38.23 15.88,35.18 10.03,29.34 10.03,26.16 13.59,22.61 19.51,22.61 OSC1.34 21.12,21 v1(21.21,21)
  Bottom Layer w0.254: v1(21.21,21) 33.86,21 36.7,18.16 40.08,18.16 42.16,16.08 42.16,12.7 38.98,9.52 H4.2
$1N5715: length 6.7
  Top Layer w0.254: v1(34.23,35.69) 34.23,31.82 33.02,30.61 PWR.1
$1N6381: length 5.7
  Bottom Layer w0.254: 10K.2 16.97,29.05 H1.3
$1N6407: length 5.7
  Bottom Layer w0.254: 10K#2.1 12.47,24.8 15.17,27.5 H1.4
$1N15357: length 2.1
  Top Layer w0.254: USER.1 12.61,9.02 v1(10.6,9.02)
$1N15535: length 4.3
  Top Layer w0.254: USB1.B5 8.45,35.16 v1(7.11,35.16)
$1N15536: length 4.3
  Top Layer w0.254: v1(8.96,37.08) 8.96,36.07 USB1.A5

## Copper pours and planes (outline as drawn; the poured copper is in the pictures)
GND on Top Layer: 2.67,41.4 41.02,41.4 41.02,2.92 2.67,2.92
GND on Bottom Layer: 2.67,41.4 41.02,41.4 41.02,2.92 2.67,2.92

Small or netless copper shapes (teardrops, artwork), in the pictures only: 114 on Top Layer, 33 on Bottom Layer

## Text on the board
Top Silkscreen Layer: OSC32IN | OSC32OUT | OSCIN | OSCOUT | GND | PC13 | PA0 | PA1 | PB11 | PB10 | BOOT1 | PB1 | PB0 | PA7 | PA6 | PA5 | PA4 | PA3 | SWDIO | PA12 | PA11 | PA10 | PA9 | PB15 | PB14 | PB13 | PB12 | SWDCLK | PA15 | PB3 | PB4 | PB5 | PB6 | PB7 | BOOT0 | PB8 | PB9 | PA8
